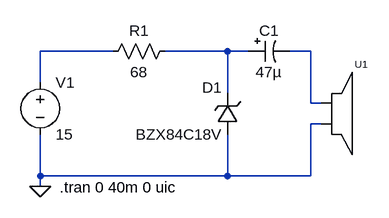
[diagram p0: schematic AudZenerOsc.asc]
AudZenerOsc.asc, the LTspice schematic file:
Version 4
SHEET 1 880 680
WIRE 128 256 128 208
WIRE 128 400 128 336
WIRE 128 416 128 400
WIRE 240 208 128 208
WIRE 416 208 320 208
WIRE 416 272 416 208
WIRE 416 400 128 400
WIRE 416 400 416 336
WIRE 448 208 416 208
WIRE 544 208 512 208
WIRE 544 288 544 208
WIRE 544 400 416 400
WIRE 544 400 544 320
WIRE 560 288 544 288
WIRE 560 320 544 320
FLAG 128 416 0
SYMBOL voltage 128 240 R0
WINDOW 123 0 0 Left 0
WINDOW 39 0 0 Left 0
SYMATTR InstName V1
SYMATTR Value 15
SYMBOL zener 432 336 R180
WINDOW 0 24 72 Left 0
WINDOW 3 24 0 Left 0
SYMATTR InstName D1
SYMATTR Value BZX84C18V
SYMBOL res 336 192 R90
WINDOW 0 0 56 VBottom 0
WINDOW 3 32 56 VTop 0
SYMATTR InstName R1
SYMATTR Value 68
SYMBOL polcap 448 192 M90
WINDOW 0 0 32 VBottom 0
WINDOW 3 32 32 VTop 0
SYMATTR InstName C1
SYMATTR Value 47µ
SYMATTR Description Capacitor
SYMATTR Type cap
SYMATTR SpiceLine V=25 Irms=120m Rser=1 MTBF=1000 Lser=0 mfg="Panasonic" pn="ECA1EFQ270" type="Al electrolytic" ppPkg=1
SYMBOL Robertugo\\parlante 592 304 R0
SYMATTR InstName U1
SYMATTR SpiceModel VINT10
TEXT 158 418 Left 0 !.tran 0 40m 0 uic

The netlist it stands for:
* AudZenerOsc.asc
V1 N001 0 15
D1 0 N002 BZX84C18V
R1 N002 N001 68
C1 N002 N003 47µ V=25 Irms=120m Rser=1 MTBF=1000 Lser=0 mfg="Panasonic" pn="ECA1EFQ270" type="Al electrolytic" ppPkg=1
XU1 N003 0 parlante  ; pins Sp1 Sp2
.model D D
.lib standard.dio
.tran 0 40m 0 uic
.backanno
.end